# EAGLE design ra8875_40pin_REV-D (EAGLE 6.4)
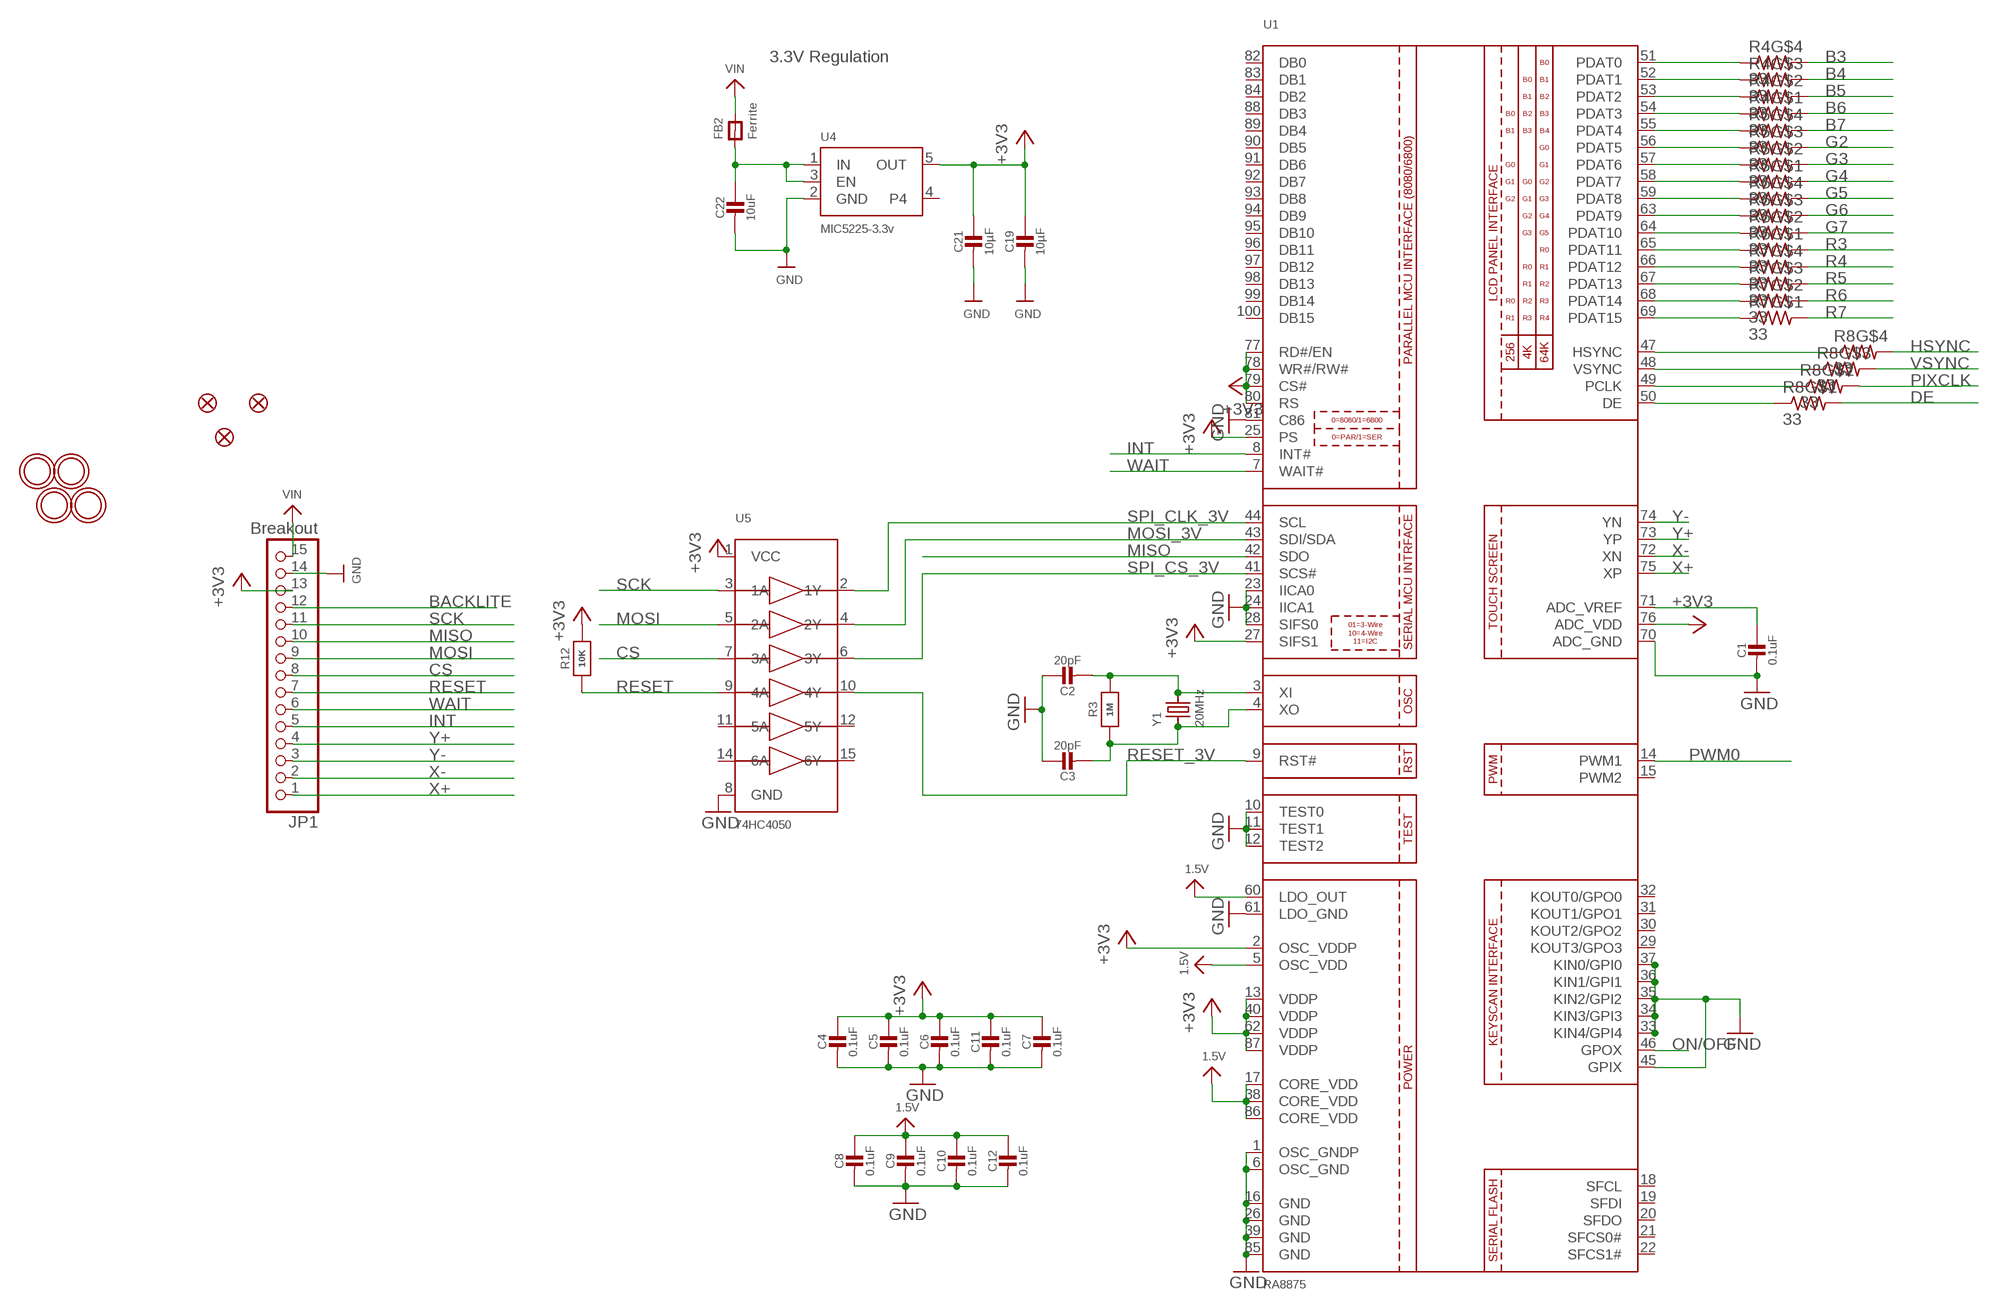
[diagram p0: schematic, sheet 1, part 1 of 2]
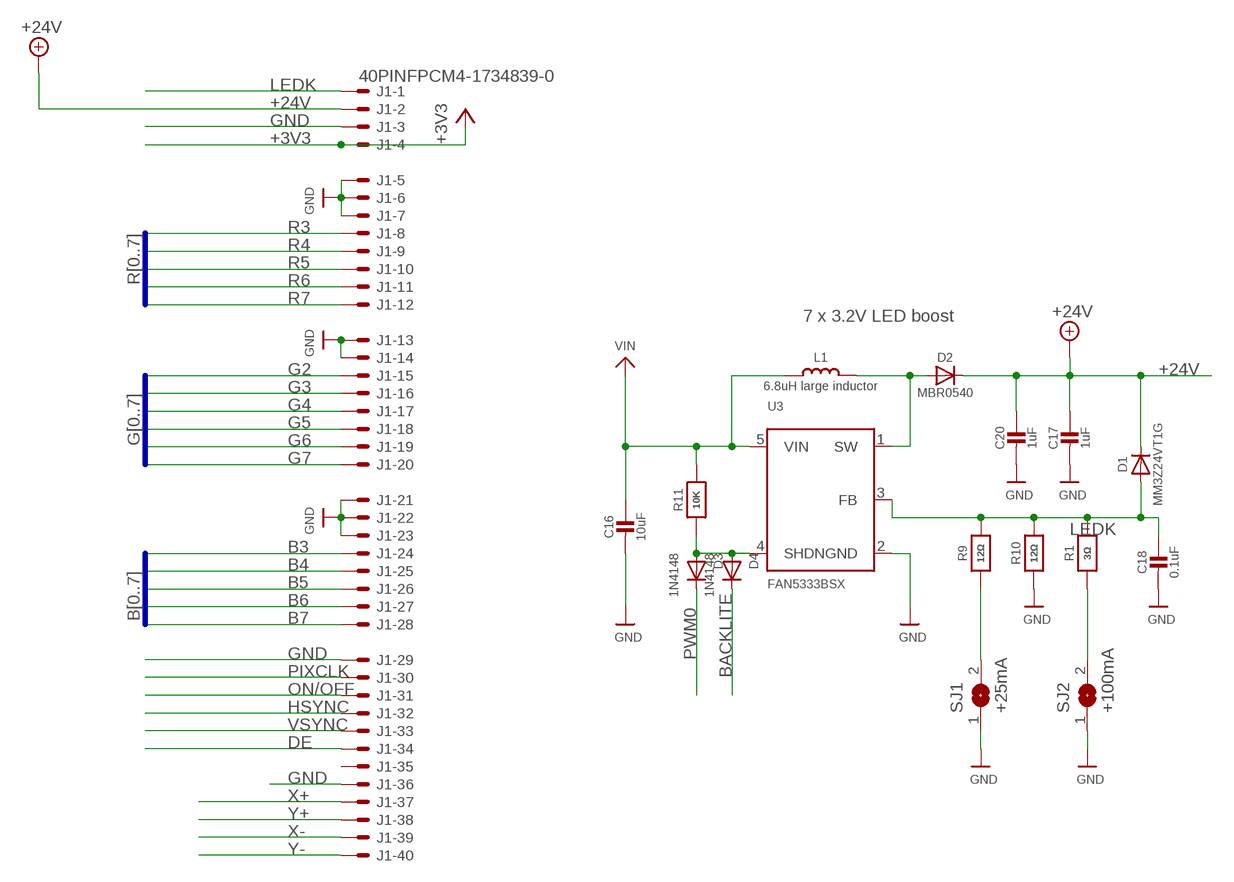
[diagram p1: schematic, sheet 1, part 2 of 2]

## Parts
C1  0.1uF  CAP_CERAMIC0805-NOOUTLINE  [0805-NO]
C2  20pF  CAP_CERAMIC0805-NOOUTLINE  [0805-NO]
C3  20pF  CAP_CERAMIC0805-NOOUTLINE  [0805-NO]
C4  0.1uF  CAP_CERAMIC0805-NOOUTLINE  [0805-NO]
C5  0.1uF  CAP_CERAMIC0805-NOOUTLINE  [0805-NO]
C6  0.1uF  CAP_CERAMIC0805-NOOUTLINE  [0805-NO]
C7  0.1uF  CAP_CERAMIC0805-NOOUTLINE  [0805-NO]
C8  0.1uF  CAP_CERAMIC0805-NOOUTLINE  [0805-NO]
C9  0.1uF  CAP_CERAMIC0805-NOOUTLINE  [0805-NO]
C10  0.1uF  CAP_CERAMIC0805-NOOUTLINE  [0805-NO]
C11  0.1uF  CAP_CERAMIC0805-NOOUTLINE  [0805-NO]
C12  0.1uF  CAP_CERAMIC0805-NOOUTLINE  [0805-NO]
C16  10uF  CAP_CERAMIC_0805MP  [_0805MP]
C17  1uF  CAP_CERAMIC_0805MP  [_0805MP]
C18  0.1uF  CAP_CERAMIC_0805MP  [_0805MP]
C19  10µF  CAP_CERAMIC_0805MP  [_0805MP]
C20  1uF  CAP_CERAMIC_0805MP  [_0805MP]
C21  10µF  CAP_CERAMIC_0805MP  [_0805MP]
C22  10uF  CAP_CERAMIC_0805MP  [_0805MP]
D1  MM3Z24VT1G  DIODESMA  [SMADIODE]
D2  MBR0540  DIODESOD-123  [SOD-123]
D3  1N4148  DIODESOD-323F  [SOD-323F]
D4  1N4148  DIODESOD-323F  [SOD-323F]
FB2  Ferrite  FERRITE_0805MP  [_0805MP]
FID1  FIDUCIAL""  [FIDUCIAL_1MM]
FID2  FIDUCIAL""  [FIDUCIAL_1MM]
FID3  FIDUCIAL""  [FIDUCIAL_1MM]
J1  40PINFPCM4-1734839-0  [4-1734839-0]
JP1  Breakout  PINHD-1X15-CB  [1X15-CB]
L1  6.8uH large inductor  INDUCTORNR5040  [INDUCTOR_5X5MM_NR5040_NOTHERMALS]
R1  3Ω  RESISTOR_0805MP  [_0805MP]
R3  1M  RESISTOR0805_NOOUTLINE  [0805-NO]
R4  33  RESISTOR_4PACK_US  [RESPACK_4X0603]
R5  33  RESISTOR_4PACK_US  [RESPACK_4X0603]
R6  33  RESISTOR_4PACK_US  [RESPACK_4X0603]
R7  33  RESISTOR_4PACK_US  [RESPACK_4X0603]
R8  33  RESISTOR_4PACK_US  [RESPACK_4X0603]
R9  12Ω  RESISTOR_0805MP  [_0805MP]
R10  12Ω  RESISTOR_0805MP  [_0805MP]
R11  10K  RESISTOR_0805MP  [_0805MP]
R12  10K  RESISTOR0805_NOOUTLINE  [0805-NO]
SJ1  +25mA  SOLDERJUMPER  [SOLDERJUMPER_ARROW_NOPASTE]
SJ2  +100mA  SOLDERJUMPER  [SOLDERJUMPER_ARROW_NOPASTE]
U1  RA8875  [LQFP100]
U3  FAN5333BSX  FAN5331  [SOT23-5@1]
U4  MIC5225-3.3v  VREG_SOT23-5  [SOT23-5]
U5  74HC4050  74HC4050D  [SOIC16]
U$21  MOUNTINGHOLE2.5  [MOUNTINGHOLE_2.5_PLATED]
U$22  MOUNTINGHOLE2.5  [MOUNTINGHOLE_2.5_PLATED]
U$23  MOUNTINGHOLE2.5  [MOUNTINGHOLE_2.5_PLATED]
U$24  MOUNTINGHOLE2.5  [MOUNTINGHOLE_2.5_PLATED]
Y1  20MHz  CRYSTAL3.2X2.5  [CRYSTAL_3.2X2.5]

## Nets
1.5V: C8.1 C9.1 C10.1 C12.1 U1.5(OSC_VDD) U1.17(CORE_VDD) U1.38(CORE_VDD) U1.60(LDO_OUT) U1.86(CORE_VDD)
+3V3: C4.1 C5.1 C6.1 C7.1 C11.1 C19.1 C21.1 J1.4 JP1.13 R12.2 U1.2(OSC_VDDP) U1.13(VDDP) U1.25(PS) U1.27(SIFS1) U1.40(VDDP) U1.62(VDDP) U1.76(ADC_VDD) U1.77(RD#/EN) U1.78(WR#/RW#) U1.79(CS#) U1.80(RS) U1.87(VDDP) U4.5(OUT) U5.1(VCC)
+24V: C17.1 C20.1 D1.C D2.C J1.2
B3: J1.24 R4.5
B4: J1.25 R4.6
B5: J1.26 R4.7
B6: J1.27 R4.8
B7: J1.28 R5.5
BACKLITE: D4.C JP1.12
CS: JP1.8 U5.7(3A)
DE: J1.34 R8.8
G2: J1.15 R5.6
G3: J1.16 R5.7
G4: J1.17 R5.8
G5: J1.18 R6.5
G6: J1.19 R6.6
G7: J1.20 R6.7
GND: C1.2 C2.1 C3.1 C4.2 C5.2 C6.2 C7.2 C8.2 C9.2 C10.2 C11.2 C12.2 C16.2 C17.2 C18.2 C19.2 C20.2 C21.2 C22.2 J1.3 J1.5 J1.6 J1.7 J1.13 J1.14 J1.21 J1.22 J1.23 J1.29 J1.36 JP1.14 R10.1 SJ1.1 SJ2.1 U1.1(OSC_GNDP) U1.6(OSC_GND) U1.10(TEST0) U1.11(TEST1) U1.12(TEST2) U1.16(GND) U1.23(IICA0) U1.24(IICA1) U1.26(GND) U1.28(SIFS0) U1.33(KIN4/GPI4) U1.34(KIN3/GPI3) U1.35(KIN2/GPI2) U1.36(KIN1/GPI1) U1.37(KIN0/GPI0) U1.39(GND) U1.45(GPIX) U1.61(LDO_GND) U1.70(ADC_GND) U1.81(C86) U1.85(GND) U3.2(GND) U4.2(GND) U5.8(GND)
HSYNC: J1.32 R8.5
INT: JP1.5 U1.8(INT#)
LEDK: C18.1 D1.A J1.1 R1.2 R9.2 R10.2 U3.3(FB)
MISO: JP1.10 U1.42(SDO)
MOSI: JP1.9 U5.5(2A)
MOSI_3V: U1.43(SDI/SDA) U5.4(2Y)
N$1: D2.A L1.P$2 U3.1(SW)
N$2: C2.2 R3.2 U1.3(XI) Y1.2
N$3: C1.1 U1.71(ADC_VREF)
N$4: R4.4 U1.51(PDAT0)
N$5: R4.3 U1.52(PDAT1)
N$6: R4.2 U1.53(PDAT2)
N$7: R4.1 U1.54(PDAT3)
N$8: R5.4 U1.55(PDAT4)
N$9: R5.3 U1.56(PDAT5)
N$10: R5.2 U1.57(PDAT6)
N$11: R5.1 U1.58(PDAT7)
N$12: R6.4 U1.59(PDAT8)
N$13: R6.3 U1.63(PDAT9)
N$14: R6.2 U1.64(PDAT10)
N$15: R6.1 U1.65(PDAT11)
N$16: R7.4 U1.66(PDAT12)
N$17: R7.3 U1.67(PDAT13)
N$18: R7.2 U1.68(PDAT14)
N$19: R7.1 U1.69(PDAT15)
N$20: R8.1 U1.50(DE)
N$21: R8.2 U1.49(PCLK)
N$22: R8.3 U1.48(VSYNC)
N$23: R8.4 U1.47(HSYNC)
N$24: R9.1 SJ1.2
N$25: C22.1 FB2.1 U4.1(IN) U4.3(EN)
N$26: R1.1 SJ2.2
N$28: C3.2 R3.1 U1.4(XO) Y1.1
ON/OFF: J1.31 U1.46(GPOX)
PIXCLK: J1.30 R8.7
PWM0: D3.C U1.14(PWM1)
R3: J1.8 R6.8
R4: J1.9 R7.5
R5: J1.10 R7.6
R6: J1.11 R7.7
R7: J1.12 R7.8
RESET: JP1.7 R12.1 U5.9(4A)
RESET_3V: U1.9(RST#) U5.10(4Y)
SCK: JP1.11 U5.3(1A)
SHDN: D3.A D4.A R11.1 U3.4(SHDN)
SPI_CLK_3V: U1.44(SCL) U5.2(1Y)
SPI_CS_3V: U1.41(SCS#) U5.6(3Y)
VIN: C16.1 FB2.2 JP1.15 L1.P$1 R11.2 U3.5(VIN)
VSYNC: J1.33 R8.6
WAIT: JP1.6 U1.7(WAIT#)
X+: J1.37 JP1.1 U1.75(XP)
X-: J1.39 JP1.2 U1.72(XN)
Y+: J1.38 JP1.4 U1.73(YP)
Y-: J1.40 JP1.3 U1.74(YN)
Unconnected: J1.35 U1.15(PWM2) U1.18(SFCL) U1.19(SFDI) U1.20(SFDO) U1.21(SFCS0#) U1.22(SFCS1#) U1.29(KOUT3/GPO3) U1.30(KOUT2/GPO2) U1.31(KOUT1/GPO1) U1.32(KOUT0/GPO0) U1.82(DB0) U1.83(DB1) U1.84(DB2) U1.88(DB3) U1.89(DB4) U1.90(DB5) U1.91(DB6) U1.92(DB7) U1.93(DB8) U1.94(DB9) U1.95(DB10) U1.96(DB11) U1.97(DB12) U1.98(DB13) U1.99(DB14) U1.100(DB15) U4.4 U5.11(5A) U5.12(5Y) U5.14(6A) U5.15(6Y)

## Buses
R[0..7]
G[0..7]
B[0..7]

## Notes on the sheet
- 3.3V Regulation
- 7 x 3.2V LED boost

## Library data of the parts
C1-C12 C16-C22 = microbuilder:CAP_CERAMIC: Ceramic Capacitors For new designs, use the packages preceded by an '_' character since they are more reliable: The following footprints should be used on most boards: _0402 - Standard footprint for regular board layouts _0603 - Standard footprint for regular board layouts _0805 - Standard footprint for regular board layouts _1206 - Standard footprint for regular board layouts For extremely tight-pitch boards where space is at a premium, the following 'micro-pitch' footprints can be used (smaller pads, no silkscreen outline, etc.): _0402MP - Micro-pitch footprint for very dense/compact boards _0603MP - Micro-pitch footprint for very dense/compact boards _0805MP - Micro-pitch footprint for very dense/compact boards _1206MP - Micro-pitch footprint for very dense/compact boards
D1 D2 = microbuilder:DIODE: Diode
D3 D4 = adafruit:DIODE: Diode
FB2 = microbuilder:FERRITE: Ferrite Bead 0603 MMZ1608B121C - 120 Ohm @ 100MHz, 600mA, 0.15 Ohm DC Resistance - Digikey: 445-2164-1-ND BK1608HW121-T - 120 Ohm, 600mA Ferrite Chip - Digikey: 587-1876-2-ND 0805 HZ0805B272R-10 - 2.7K Ohm @ 100MHz, 200mA, 0.8 Ohm DC Resistance - Digikey: 240-2504-1-ND (see also Murata BLM21BD272SN1L) MMZ2012Y152B - 1.5K Ohm @ 100MHz, 500mA, 0.4 Ohm DC Resistance - Digikey: 445-1560-1-ND - Mainly for high frequency (80-400MHz) MMZ2012R102A - 1K Ohm @ 100MHz, 500mA, 0.3 Ohm DC Resistance - Digikey: 445-1555-2-ND - More general purpose (10-200MHz)
FID1-FID3 = microbuilder:FIDUCIAL: Fiducial Alignment Points Various fiducial points for machine vision alignment.; BOM: EXCLUDE
J1 = adafruit:40PINFPC: OMRON FPC Connector Source : http://www.omron.com/ecb/products/pdf/fpc.pdf XF2M-4015-rev is good for connecting up 'PSP' SHARP LQ043 LCDs
JP1 = adafruit:PINHD-1X15: PIN HEADER
L1 = microbuilder:INDUCTOR: Inductors 0603: 10nH Ceramic Inductor - microwire antenna/RF (Digikey: 712-1434-2-ND) 0805: 560nH Ceramic Inductor - RF (Digikey: 553-1047-1-ND) 270nH Ceramic Inductor - Q = 40@250MHz, +-5%, 1 Ohm DC Resistance (Digikey: 535-10506-2-ND) 1007 (2518 Metric) SMT: 10µH 10% 250mOhm 820mA 1007 Inductor (Digikey: 587-2189-1-ND) 22µH 10% 500mOhm 580mA 1007 Inductor (Digikey: 587-2190-1-ND) 47µH 10% 950mOhm 420mA 1007 Inductor (Digikey: 587-2191-1-ND) 47µH 5% 100mOhm 1A 1008 Inductor (Digikey: 732-1816-1-ND) 5.0x5.0mm (Taiyo Yuden NR5040 Series) 6.8µH 20% 2.3A 64mOhm Inductor (Digikey: 587-2374-2-ND) 5.0x5.0mm (TDK VLC5045 Series) 4.7µH 20% 3.3A 34mOhm Inductor (Digikey: 445-6526-1-ND) 6.8µH 20% 2.7A 46mOhm Inductor (Digikey: 445-6527-1-ND) 6.0x6.0mm (TDK VLC6045 Series) 4.7µH 20% 3.8A 27mOhm Inductor (Digikey: 445-6538-2-ND) 6.8µH 20% 3A 41mOhm Inductor (Digikey: 445-6540-1-ND) 6.2µH 30% 2.2A 45mOhm Inductor (Digikey: SRR5028-6R2YCT-ND) - Not TDK VLC6045 but footprint should match 6.0x6.0mm (TDK SLF6045 Series) 6.8uH 30% 2A 33mOhm Inductor (Digikey: 445-4572-1-ND, Mouser: 810-SLF645T6R8N2R0PF) 6.0x6.0mm (Sumida CDRH5D28 Series) 6.2uH 30% 1.8A 45mOhm Inductor (Digikey: 308-1542-1-ND) Taiyo Yuden NR3015T2R2M - 2.2uH 20% 1.5A (Digikey: 587-1648-2-ND, Mouser: 963-NR3015T2R2M) - Used with TI TPS62172 CoilCraft RFID Transponder Coil - MA5532-AE (For use with AS3935 Lightning Sensor)
R1 R3 R9-R12 = microbuilder:RESISTOR: Resistors For new designs, use the packages preceded by an '_' character since they are more reliable: The following footprints should be used on most boards: _0402 - Standard footprint for regular board layouts _0603 - Standard footprint for regular board layouts _0805 - Standard footprint for regular board layouts _1206 - Standard footprint for regular board layouts For extremely tight-pitch boards where space is at a premium, the following 'micro-pitch' footprints can be used (smaller pads, no silkscreen outline, etc.): _0402MP - Micro-pitch footprint for very dense/compact boards _0603MP - Micro-pitch footprint for very dense/compact boards _0805MP - Micro-pitch footprint for very dense/compact boards _1206MP - Micro-pitch footprint for very dense/compact boards
R4-R8 = microbuilder:RESISTOR_4PACK_US: Resistor Packs (4 resistors) 4 x 0603 10K 1/16W - Digikey: YC164J-10KCT-ND
SJ1 SJ2 = microbuilder:SOLDERJUMPER: SMD Solder JUMPER Solder the two pads together to create a connection, or remove the solder to break it. REFLOW - Use this footprint for solder paste and reflow ovens. WAVE - Use this footprint for hand-soldering (larger pads). CLOSED - Has a trace between the two pads to ensure it is closed by default. The trace needs to be cut to disable the jumper, and can be closed again by creating a solder bridge between the two pads.; BOM: EXCLUDE
U1 = microbuilder:RA8875: RA8875 TFT LCD Controller
U3 = microbuilder:FAN5331: FAN5331 - LED/OLED 20V Boost Converter Digikey: FAN5331SXCT-ND
U4 = microbuilder:VREG_SOT23-5: SOT23-5 Fixed Voltage Regulators Part Current Out V Out V In V Dropout θJA (°C/W) TJ (°C) Digikey Part No. ADP121 150mA 3.3V 3.4-5.5V 0.09V @ 150mA -- -- ADP121-AUJZ33R7CT-ND ADP121 150mA 3.0V 3.1-5.5V 0.09V @ 150mA -- -- ADP121-AUJZ30R7CT-ND ADP122 300mA 3.3V 3.4-5.5V 0.085V @ 300mA -- -- ADP122AUJZ-3.3-R7CT-ND ADP1712 300mA 3.3V 3.5-5.5V 0.17V @ 300mA -- -- ADP1712AUJZ-3.3-R7TR-ND AP7311 (Low Cost) 150mA 3.3V 3.5-6V 0.15V @ 150mA -- -- AP7311-33WG-7DICT-ND LD39015M18R 150mA 1.8V 1.9V-5.5V 0.08V @ 100mA -- -- 497-6977-1-ND LP2985A-33DBVR 150mA 3.3V 3.3-16V 0.28V @ 150mA 206 150 296-18479-1-ND MCP1824T-3302E/OT 300mA 3.3V 3.5V-6V 0.2V @ 300mA -- -- MCP1824T-3302E/OTCT-ND MIC5205-2.5YM5 TR 150mA 2.5V 2.7-16V 0.165V @ 150mA -- -- 576-1257-2-ND MIC5205-3.0YM5 TR 150mA 3.0V 3.2V-16V 0.165V @ 150mA -- -- 576-1258-2-ND MIC5205-3.3YM5 TR 150mA 3.3V 3.5V-16V 0.165V @ 150mA -- -- 576-1259-2-ND TPS780330220 150mA 3.3V+2.2V 3.6-5.5V 250mV Max -- -- 296-23332-1-ND TDA3663/N1,135 100mA 3.3V 3.5-45V 0.18V @ 50mA -- -- 568-5343-1-ND Max operating temp can be calculated using θJA, TJ (max junction temperature), and power in watts. Set the "Maximum Ambient Temperature" until it reaches TJ ("Max Junction Temperature"), which is the absolute limit for safe use of the regulator: Heat Sink Temperature Calculator <http://www.daycounter.com/Calculators/Heat-Sink-Temperature-Calculator.phtml> For example, With 12V source into a 3.3V LP2985 and a 30mA load, we are dissipating (12V-3.3V) * 0.03A = 0.261W. With a θJA of 206 °C/W, a TJ of 150°C, and 261mW we can safely use the chip without a heat sink up to 75°C (=147.1°C Junction Temperature).
U5 = microbuilder:74HC4050D: 6-channel level shifter 74HC4050D - 2V-6V Supply SOIC16 Digikey: 74HC4050D,653-ND Mouser: 771-74HC4050D-T TSSOP16 Digikey: 296-9215-1-ND Mouser:
U$21-U$24 = microbuilder:MOUNTINGHOLE: Mounting Hole For #2 screws (0.086"/2.18mm width, 0.094"/2.4mm hole) use 2.5mm; BOM: EXCLUDE
Y1 = microbuilder:CRYSTAL: Crystals HC49UP - Surface Mount Crystal 4.0MHz 18pF +/-30ppm Surface Mount Crystal [Digikey: 535-9857-1-ND] 12.0 MHz Surface Mount Crystal [Digikey: 535-9869-6-ND] 25.0 MHz Surface Mount Crystal [Digikey: 535-9078-1-ND] 2.5 x 2.0mm - MEMs SMT Crystal 16.0 MHz 10pF 20ppm 2.5 x 2.0mm Crystal [Digikey -40-85°C: 535-10923-1-ND] 3.2 x 2.5mm - MEMs SMT Crystal 12.0 MHz 8pF 15ppm 3.2 x 2.5mm Crystal [Digikey: -10-70°C: 644-1047-1-ND -40-125°C: 644-1128-1-ND] 40~85°C cheaper: 644-1173-6-ND 16.0 MHz 8pF 15ppm 3.2 x 2.5mm Crystal [Digikey: -10-70°C: 644-1049-1-ND -40-125°C: 644-1129-2-ND]-40~85°C cheaper: 644-1175-6-ND 16.0 MHz 10pF 10ppm 3.2 x 2.5mm Crystal [Digikey: 644-1100-1-ND] 27.12 MHz 18pF 30ppm 3.2 x 2.5mm Crystal [Digikey: 887-1424-1-ND] 27.12MHz 10pF 10ppm 3.2 x 2.5mm Crystal [Digikey: 887-1329-1-ND] 4.9 x 1.8mm - MEMs SMT Crystal 32.768 KHz 12.5pF 20ppm 4.9 x 1.8mm Crystal [Digikey: SE2415CT-ND] 8.0 x 3.8mm - Surface Mount Crystal 32.768kHz 12.5pF 20ppm -40°C-85°C [Digikey: 535-9166-2-ND] Cylinder 32.768KHz Cylinder Crystal (2x6mm body) [Ex. Digikey: 300-8341-2-ND]

## Board
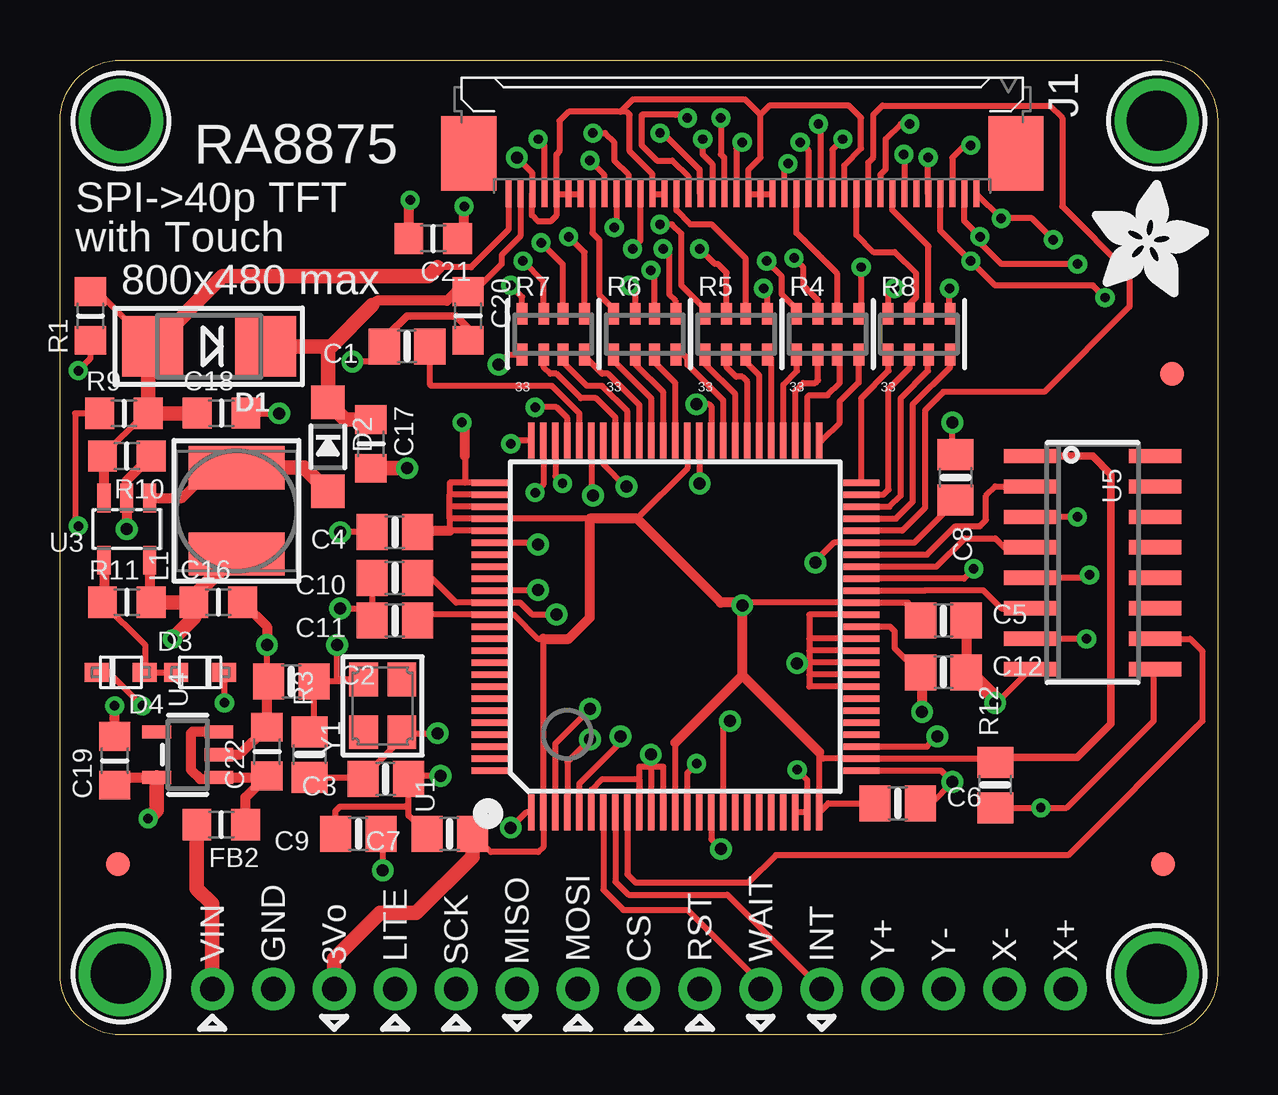
[diagram p2: board, top side]
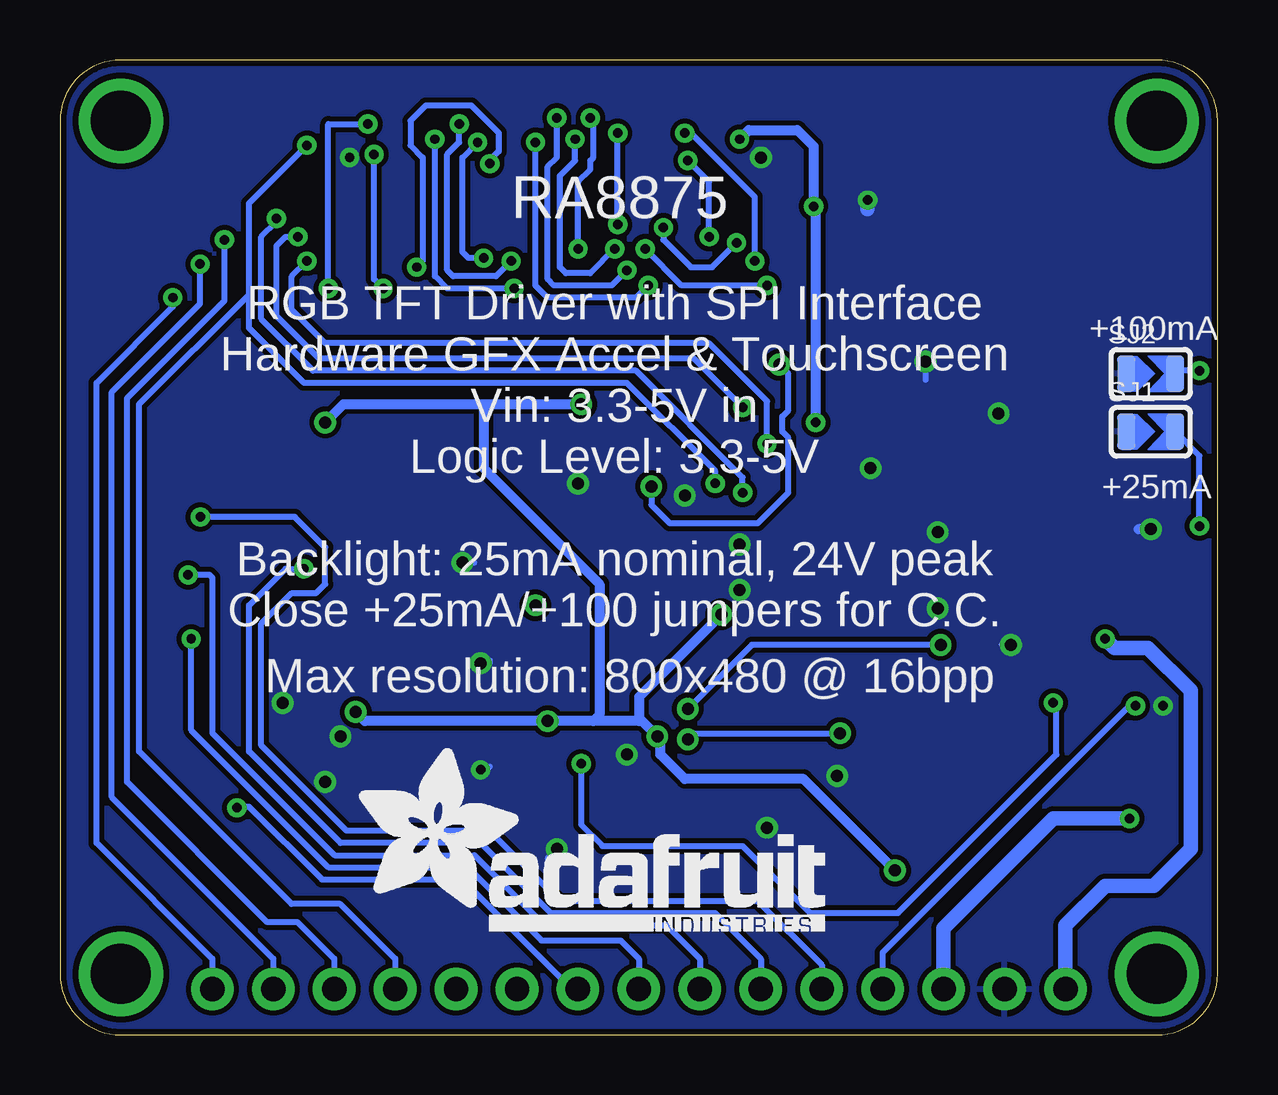
[diagram p3: board, bottom side, seen from below]

Size 48.26 x 40.64 mm. Coordinates in mm from the lower left corner, seen from the top.
Outline: 2.54,40.64 45.72,40.64 arc-90 48.26,38.1 48.26,2.54 arc-90 45.72,0 2.54,0 arc-90 0,2.54 0,38.1 arc-90 2.54,40.64
Copper layers (1*16): Top 0.035mm / dielectric 1.5mm / Bottom 0.035mm
Design rules "adafruit *": minimum track width 8mil, minimum drill 15.5mil, track to track 8mil, track to pad 8mil, pad to pad 8mil, via to via 8mil, smd to smd 8mil, copper to edge 10mil, drill to drill 8mil, minimum pad ring 10mil, minimum via ring 8mil, stop-mask expansion 4mil, vias tented up to drill 20mil, thermal gap 10mil

### Footprints (pad centres in the part's own frame; a part is rotated, then mirrored left to right if it is on the bottom)
0805-NO = smd 1.3 x 1.5: 1 -0.95,0; 2 0.95,0
_0805MP = smd 1.2 x 1.3: 1 -1.016,0; 2 1.016,0
SMADIODE = smd 2.54 x 2.54: A 2.349,0; C -2.349,0
SOD-123 = smd 1.4 x 1.4: A 1.85,0; C -1.85,0
SOD-323F = smd 1 x 0.8: A -1,0; C 1,0
FIDUCIAL_1MM = smd 1 x 1: 1 0,0
4-1734839-0 = smd 0.25 x 1.1: 1 -9.75,-2.54; 2 -9.25,-2.54; 3 -8.75,-2.54; 4 -8.25,-2.54; 5 -7.75,-2.54; 6 -7.25,-2.54; 7 -6.75,-2.54; 8 -6.25,-2.54; 9 -5.75,-2.54; 10 -5.25,-2.54; 11 -4.75,-2.54; 12 -4.25,-2.54; 13 -3.75,-2.54; 14 -3.25,-2.54; 15 -2.75,-2.54; 16 -2.25,-2.54; 17 -1.75,-2.54; 18 -1.25,-2.54; 19 -0.75,-2.54; 20 -0.25,-2.54; 21 0.25,-2.54; 22 0.75,-2.54; 23 1.25,-2.54; 24 1.75,-2.54; 25 2.25,-2.54; 26 2.75,-2.54; 27 3.25,-2.54; 28 3.75,-2.54; 29 4.25,-2.54; 30 4.75,-2.54; 31 5.25,-2.54; 32 5.75,-2.54; 33 6.25,-2.54; 34 6.75,-2.54; 35 7.25,-2.54; 36 7.75,-2.54; 37 8.25,-2.54; 38 8.75,-2.54; 39 9.25,-2.54; 40 9.75,-2.54 | smd 2.3 x 3.1: M1 11.4,-0.84; M2 -11.4,-0.84
1X15-CB = drill 1.016 pad 1.778: 1 -17.78,0; 2 -15.24,0; 3 -12.7,0; 4 -10.16,0; 5 -7.62,0; 6 -5.08,0; 7 -2.54,0; 8 0,0; 9 2.54,0; 10 5.08,0; 11 7.62,0; 12 10.16,0; 13 12.7,0; 14 15.24,0; 15 17.78,0
INDUCTOR_5X5MM_NR5040_NOTHERMALS = smd 1.8 x 4: P$1 -1.8,0; P$2 1.8,0
RESPACK_4X0603 = smd 0.45 x 0.9: 1 -1.3,-0.85; 2 -0.4,-0.85; 3 0.4,-0.85; 4 1.3,-0.85; 5 1.3,0.85; 6 0.4,0.85; 7 -0.4,0.85; 8 -1.3,0.85
SOLDERJUMPER_ARROW_NOPASTE = smd 0.762 x 1.524: 1 -1.016,0; 2 1.016,0
LQFP100 = smd 0.27 x 1.5: 1 -6,-7.75; 2 -5.5,-7.75; 3 -5,-7.75; 4 -4.5,-7.75; 5 -4,-7.75; 6 -3.5,-7.75; 7 -3,-7.75; 8 -2.5,-7.75; 9 -2,-7.75; 10 -1.5,-7.75; 11 -1,-7.75; 12 -0.5,-7.75; 13 0,-7.75; 14 0.5,-7.75; 15 1,-7.75; 16 1.5,-7.75; 17 2,-7.75; 18 2.5,-7.75; 19 3,-7.75; 20 3.5,-7.75; 21 4,-7.75; 22 4.5,-7.75; 23 5,-7.75; 24 5.5,-7.75; 25 6,-7.75; 51 6,7.75; 52 5.5,7.75; 53 5,7.75; 54 4.5,7.75; 55 4,7.75; 56 3.5,7.75; 57 3,7.75; 58 2.5,7.75; 59 2,7.75; 60 1.5,7.75; 61 1,7.75; 62 0.5,7.75; 63 0,7.75; 64 -0.5,7.75; 65 -1,7.75; 66 -1.5,7.75; 67 -2,7.75; 68 -2.5,7.75; 69 -3,7.75; 70 -3.5,7.75; 71 -4,7.75; 72 -4.5,7.75; 73 -5,7.75; 74 -5.5,7.75; 75 -6,7.75 | smd 1.5 x 0.27: 26 7.75,-6; 27 7.75,-5.5; 28 7.75,-5; 29 7.75,-4.5; 30 7.75,-4; 31 7.75,-3.5; 32 7.75,-3; 33 7.75,-2.5; 34 7.75,-2; 35 7.75,-1.5; 36 7.75,-1; 37 7.75,-0.5; 38 7.75,0; 39 7.75,0.5; 40 7.75,1; 41 7.75,1.5; 42 7.75,2; 43 7.75,2.5; 44 7.75,3; 45 7.75,3.5; 46 7.75,4; 47 7.75,4.5; 48 7.75,5; 49 7.75,5.5; 50 7.75,6; 76 -7.75,6; 77 -7.75,5.5; 78 -7.75,5; 79 -7.75,4.5; 80 -7.75,4; 81 -7.75,3.5; 82 -7.75,3; 83 -7.75,2.5; 84 -7.75,2; 85 -7.75,1.5; 86 -7.75,1; 87 -7.75,0.5; 88 -7.75,0; 89 -7.75,-0.5; 90 -7.75,-1; 91 -7.75,-1.5; 92 -7.75,-2; 93 -7.75,-2.5; 94 -7.75,-3; 95 -7.75,-3.5; 96 -7.75,-4; 97 -7.75,-4.5; 98 -7.75,-5; 99 -7.75,-5.5; 100 -7.75,-6
SOT23-5@1 = smd 0.55 x 1.2: 1 -0.95,-1.3; 2 0,-1.3; 3 0.95,-1.3; 4 0.95,1.3; 5 -0.95,1.3
SOT23-5 = smd 0.55 x 1.2: 1 -0.95,-1.3; 2 0,-1.3; 3 0.95,-1.3; 4 0.95,1.3; 5 -0.95,1.3
SOIC16 = smd 0.6 x 2.2: 1 -4.445,-2.6; 2 -3.175,-2.6; 3 -1.905,-2.6; 4 -0.635,-2.6; 5 0.635,-2.6; 6 1.905,-2.6; 7 3.175,-2.6; 8 4.445,-2.6; 9 4.445,2.6; 10 3.175,2.6; 11 1.905,2.6; 12 0.635,2.6; 13 -0.635,2.6; 14 -1.905,2.6; 15 -3.175,2.6; 16 -4.445,2.6
MOUNTINGHOLE_2.5_PLATED = drill 2.5 pad 3.2: P$1 0,0
CRYSTAL_3.2X2.5 = smd 1.4 x 1.2: 1 -1.1,-0.8; 2 1.1,0.8; GND1 -1.1,0.8; GND2 1.1,-0.8

### Placement (x,y rotation side)
C1  14.47,28.7 180 top
C2  9.64,14.73 0 top
C3  13.58,10.67 180 top
C4  13.96,20.95 180 top
C5  36.82,17.27 0 top
C6  34.92,9.65 0 top
C7  16.25,8.38 180 top
C8  37.33,23.24 270 top
C9  12.44,8.38 180 top
C10  13.96,19.05 180 top
C11  13.96,17.27 180 top
C12  36.82,15.11 0 top
C16  6.6,18.03 0 top
C17  12.96,24.64 270 top
C18  6.73,25.92 0 top
C19  2.28,11.43 90 top
C20  17.01,29.97 270 top
C21  15.56,33.2 180 top
C22  8.63,11.81 90 top
D1  6.21,28.7 180 top
D2  11.17,24.51 270 top
D3  5.84,15.11 0 top
D4  2.54,15.11 180 top
FB2  6.72,8.76 180 top
FID1  2.41,7.11 0 top
FID2  45.97,7.11 0 top
FID3  46.35,27.56 0 top
J1  28.44,37.59 0 top
JP1  24.13,1.91 180 top
L1  7.36,21.84 90 top
R1  1.27,29.97 90 top
R3  10.41,11.68 90 top
R4  32,29.21 0 top
R5  28.19,29.21 0 top
R6  24.38,29.21 0 top
R7  20.57,29.21 0 top
R8  35.81,29.21 0 top
R9  2.67,25.91 0 top
R10  2.79,24.13 180 top
R11  2.79,18.03 0 top
R12  38.98,10.41 90 top
SJ1  2.79,25.15 0 bottom
SJ2  2.79,27.56 0 bottom
U1  25.65,17.02 0 top
U3  2.79,21.08 180 top
U4  5.33,11.68 90 top
U5  43.05,19.68 270 top
U$18  [ADAFRUIT_5MM]  43.02,30.76 0 top
U$21  2.54,38.1 0 top
U$22  45.72,38.1 0 top
U$23  45.72,2.54 0 top
U$24  2.54,2.54 0 top
U$25  [ADAFRUIT_TEXT_20MM]  35.94,4.32 0 bottom
Y1  13.45,13.72 90 top

### Tracks (layer width: path | path; a pad name or v marks a point on that pad's centre or on a via)
1.5V  (via drill 0.5)
  Top 0.254: C10.1 15.49,19.05 16.52,18.02 U1.86 19.18,18.02 19.68,17.53 v20.69,17.53 | U1.38 34.6,17.02 34.79,16.83 34.79,16.13 35.81,15.11 C12.1 35.93,15.05 | C8.1 37.2,24.32 v37.2,25.53 | U1.60 27.15,26.19 27.05,26.29 v26.54,26.29 | U1.17 27.65,12.79 v27.93,13.08 | U1.5 21.65,10.48 23.23,12.06 23.23,12.32 v23.36,12.45 | C9.1 13.45,8.32 v13.45,6.86
  Top 0.406: 35.93,15.05 v35.93,13.46
  Bottom 0.254: 24,13.08 24.12,13.08 | 23.23,12.32 v23.36,12.45
  Bottom 0.406: v37.2,25.53 36.44,26.29 30.6,26.29 | 30.6,26.29 v26.54,26.29 | v35.93,13.46 35.55,13.08 v27.93,13.08 26.03,13.08 | v23.36,12.45 24,13.08 | 26.03,13.08 24.12,13.08 24.12,14.1 v20.69,17.53 | v13.45,6.86 17.26,10.67 22.22,10.67 23.23,11.68 23.23,12.32 | 30.6,26.29 30.6,23.62 25.77,18.8 25.77,13.34 26.03,13.08
+3V3  (via drill 0.39, 0.5)
  Top 0.254: C4.1 | U1.77 16.25,22.52 | U1.76 16.88,23.02 | 16.88,23.02 16.25,23.02 16.25,22.52 | U1.78 16.25,22.02 | 16.25,22.02 16.25,22.52 | 16.25,21.52 16.25,22.02 | C11.1 15.16,17.52 U1.87 18.92,17.52 19.93,16.51 20.15,16.51 U1.2 20.15,7.83 19.93,7.62 17.96,7.62 C7.1 | 16.25,21.52 U1.79 22.09,21.52 | 16.25,21.52 16.25,21.02 U1.80 | U1.62 26.15,23.61 24.05,21.52 | C6.1 32.02,9.65 U1.25 31.65,11.68 | C5.1 35.87,17.49 35.35,18.02 U1.40 28.57,18.02 28.44,17.89 v28.44,17.91 | 31.65,11.68 31.65,11.78 | U1.13 25.65,12.19 | 31.65,11.68 31.81,11.52 U1.27 38.83,11.52 arc-90 R12.2 | J1.4 20.19,37.08 v19.93,37.34 | 16.88,24.13 16.88,23.02
  Top 0.305: U5.1 43.05,24.13 43.81,23.37 43.81,12.95 42.41,11.56 39.17,11.56 R12.2
  Top 0.406: 28.57,18.02 27.55,18.02 24.05,21.52 22.09,21.52 22.09,17.4 21.2,16.51 20.15,16.51 | 31.65,11.78 28.44,14.99 | 28.44,14.99 v28.44,17.91 | 25.65,12.19 28.44,14.99 | 16.83,34.52 v16.85,34.54 16.85,33.47 C21.1 | C4.1 14.97,21.02 16.25,21.02 | 16.88,24.13 16.88,25.4 v16.76,25.53 | U4.5 2.47,10.73 2.28,10.54 C19.1
  Top 0.61: U4.5 4.03,9.37 v3.67,9.02 | C7.1 17.2,7.43 14.85,5.08 13.34,5.08 11.43,3.17 JP1.13
  Bottom 0.406: v16.76,25.53 16.76,34.45 v16.85,34.54 16.85,37.04 17.53,37.72 19.55,37.72 v19.93,37.34
  Bottom 0.61: 28.44,17.78 v28.44,17.91 | v3.67,9.02 6.85,9.02 11.43,4.44 JP1.13
+24V
  Top 0.254: C20.1 17.26,30.99 18.41,32.13 18.41,32.51 19.19,33.3 J1.2
  Top 0.406: C20.1 16.51,30.99 16.13,30.61 13.21,30.61 13.02,30.42
  Top 0.61: D1.C 11.3,28.7 | 11.3,28.7 13.02,30.42 | C17.1 11.88,25.65 D2.C 11.17,28.57 11.3,28.7
B3  (via drill 0.39)
  Top 0.254: J1.24 30.19,36.22 30.29,36.32 v30.34,36.32 | v33.39,32 33.39,30.16 R4.5
  Bottom 0.254: v33.39,32 33.14,32.26 33.14,36.58 33.65,37.08 33.65,38.1 33.01,38.73 31.11,38.73 29.97,37.6 29.97,36.83 30.34,36.46 v30.34,36.32
B4
  Top 0.254: R4.6 32.4,31.73 30.69,33.44 J1.25
B5  (via drill 0.39)
  Top 0.254: R4.7 31.6,30.63 30.98,31.24 30.98,32 v30.6,32.38 | v30.85,37.21 31.19,36.87 J1.26
  Bottom 0.254: v30.6,32.38 31.23,32.38 31.49,32.64 31.49,36.58 v30.85,37.21
B6  (via drill 0.39)
  Top 0.254: R4.8 30.7,30.26 30.09,30.86 30.09,31.62 v29.46,32.26 | v31.61,37.97 31.69,37.9 J1.27
  Bottom 0.254: v29.46,32.26 30.09,31.62 31.87,31.62 32.12,31.88 32.12,36.7 31.61,37.21 v31.61,37.97
B7  (via drill 0.39)
  Top 0.254: R5.5 29.49,30.96 v29.33,31.11 | v32.63,37.34 32.19,36.9 J1.28
  Bottom 0.254: v29.33,31.11 32.12,31.11 32.63,31.62 v32.63,37.34
BACKLITE  (via drill 0.39)
  Top 0.254: D4.C 2.03,15.11 v3.43,13.72
  Bottom 0.254: v3.43,13.72 3.68,13.72 13.97,3.43 JP1.12
CS  (via drill 0.39)
  Top 0.254: v42.79,16.51 U5.7
  Bottom 0.254: v42.79,16.51 42.79,12.7 37.08,6.99 31.24,6.99 28.19,3.94 24.89,3.94 24.13,3.17 JP1.8
DE  (via drill 0.39)
  Top 0.254: v35.17,36.7 35.19,36.68 J1.34 | v34.79,31.11 34.51,30.83 R8.8
  Bottom 0.254: v34.79,31.11 35.17,31.5 v35.17,36.7
G2
  Top 0.254: R5.6 28.59,32.37 27.17,33.78 26.28,33.78 25.69,34.37 J1.15
G3  (via drill 0.39)
  Top 0.254: R5.7 27.79,31.77 27.42,32.13 27.3,32.13 v26.66,32.77 | v26.15,38.23 26.03,38.35 25.65,38.35 24.25,38.35 24.25,37.08 24.88,36.45 25.52,36.45 26.19,35.78 J1.16
  Bottom 0.254: v26.66,32.77 26.66,35.56 26.15,36.07 26.15,36.45 26.03,36.58 26.03,38.1 v26.15,38.23
G4  (via drill 0.39)
  Top 0.254: R5.8 26.89,30.26 25.9,31.24 25.9,33.4 25.52,33.78 v25.01,33.78 | J1.17 26.66,35.08 26.66,36.07 25.14,37.59 v25.01,37.59
  Bottom 0.254: v25.01,33.78 v25.01,37.59
G5  (via drill 0.39)
  Top 0.254: v26.79,37.34 26.79,36.7 27.19,36.3 J1.18 | v25.14,32.77 25.39,32.51 25.39,30.86 25.65,30.61 25.65,30.09 R6.5
  Bottom 0.254: v25.14,32.77 26.15,31.75 27.17,31.75 27.42,32 27.42,35.81 26.79,36.45 v26.79,37.34
G6  (via drill 0.39)
  Top 0.254: R6.6 24.78,31.73 v24.63,31.88 | v27.55,38.23 27.55,36.7 27.68,36.58 27.68,35.06 J1.19
  Bottom 0.254: v24.63,31.88 25.27,31.24 27.68,31.24 27.93,31.5 27.93,36.2 27.55,36.58 v27.55,38.23
G7  (via drill 0.39)
  Top 0.254: R6.7 24,30.08 24,30.99 v23.74,31.24 | v28.44,37.21 28.19,36.96 J1.20
  Bottom 0.254: v23.74,31.24 24.25,30.73 27.93,30.73 28.44,31.24 v28.44,37.21
GND  (via drill 0.39, 0.5)
  Top 0.254: C1.2 13.52,28.07 v12.18,28.07 | C10.2 13.01,17.78 | 13.01,17.78 C11.2 | C4.2 v11.68,20.95 | U1.85 17.92,18.54 v19.93,18.54 | U1.81 19.93,20.52 v19.93,20.45 | C2.1 8.63,14.8 v8.63,16.26 | U1.37 31.23,16.52 | 31.23,16.52 31.23,16.02 | 31.23,16.02 31.23,15.52 | 31.23,15.52 31.23,15.49 | 31.23,15.49 31.23,15.02 | 31.23,15.02 31.23,14.52 U1.33 | U1.34 31.23,15.02 | U1.35 31.23,15.52 | U1.36 31.23,16.02 | 31.23,15.49 v30.73,15.49 | C12.2 37.77,15.24 C5.2 37.77,17.56 | U1.61 26.65,22.99 v26.66,22.99 | U1.70 22.15,22.54 22.2,22.48 v22.22,22.48 | U1.39 31.23,17.52 31.23,16.52 | 36.89,22.29 C8.2 37.38,22.29 35.61,20.52 U1.45 32.25,20.52 31.49,19.76 v31.49,19.68 | U1.16 27.15,8.15 v27.55,7.75 | U1.12 25.15,11.18 24.65,11.18 | 24.65,11.18 24.63,11.18 | 24.63,11.18 24.15,11.18 U1.10 24.15,10.64 24.12,10.67 22.6,10.67 22.15,10.22 U1.6 | U1.11 24.65,11.18 | 24.63,11.18 v24.63,11.68 | U1.1 19.42,9.27 v18.79,8.64 | C7.2 14.53,9.15 14.53,9.65 | 14.53,9.65 C3.1 14.66,10.79 v15.87,10.79 | C9.2 11.49,9.34 11.68,9.53 14.4,9.53 14.53,9.65 | U1.26 36.73,11.02 v37.2,10.54 36.31,9.65 C6.2 | U1.23 U1.24 31.15,10.63 v30.73,11.05 | U1.28 36.14,12.02 v36.57,12.45 | J1.14 J1.13 24.69,35.88 23.74,36.83 23.74,38.35 23.61,38.48 23.36,38.48 | J1.5 20.69,36.7 20.82,36.83 20.82,38.1 21.2,38.48 23.36,38.48 | 19.17,36.45 v19.04,36.58 19.69,35.93 J1.3 19.68,35.04 19.68,34.16 19.93,33.91 20.44,33.91 20.69,34.16 J1.5 | J1.23 J1.22 J1.21 28.69,36.06 29.2,36.58 29.2,38.35 | 29.2,38.35 28.57,38.99 23.87,38.99 23.36,38.48 | J1.29 32.69,36.25 33.39,36.96 33.39,38.23 32.88,38.73 29.58,38.73 29.2,38.35 | J1.36 v36.19,36.58 | J1.5 J1.6 J1.7 | v11.68,17.78 13.01,17.78
  Top 0.254: U5.8 39.05,13.84 v38.98,13.84 | C18.2 7.75,25.91 v9.14,25.91
  Top 0.305: C20.2 17.01,29.46 16.5,29.97 14.47,29.97 13.71,29.21 13.71,28.89 C1.2
  Top 0.406: 37.77,17.56 37.77,15.24 | v2.79,21.08 U3.2 2.79,23.11 R10.1 | C16.2 8.63,17.02 v8.63,16.26 | C19.2 v2.28,13.72 | U4.2 7.49,11.68 C22.2 8.63,14.67 C2.1 | C21.2 14.54,34.74 v14.6,34.8
  Top 0.61: C17.2 v14.47,23.62 | 37.77,15.24 38.98,14.03 v38.98,13.84
  Bottom 0.254: v12.18,28.07 12.18,27.3 | v11.68,20.95 11.55,20.83 11.55,20.95 | v19.93,18.54 19.93,18.16 | v19.93,20.45 20.06,20.45 20.06,20.32 | v8.63,16.26 9.01,16.26 | 30.34,15.62 30.34,15.49 | v26.66,22.99 26.66,22.86 26.92,22.86 | v22.22,22.48 22.22,22.35 22.09,22.48 | v31.49,19.68 30.98,19.68 | v27.55,7.75 27.93,7.37 | v18.79,8.64 18.66,8.64 18.53,8.51 | 36.57,12.19 v36.57,12.45 | v19.04,36.58 19.04,36.7 | v36.19,36.58 36.06,36.7 36.06,36.32 | v30.73,11.05 30.47,11.05 30.34,11.18
  Bottom 0.406: v38.98,13.84 38.98,14.1 | v2.79,21.08 3.29,21.08
  Bottom 0.61: v14.6,34.8 14.6,34.42
  pour Bottom: 0,0 48.88,0 49.13,40.64 0.25,40.64
HSYNC  (via drill 0.39)
  Top 0.254: R8.5 37.08,30.09 v37.08,31.11 | v35.42,37.97 35.04,37.97 34.41,37.34 34.41,36.07 34.19,35.85 J1.32
  Bottom 0.254: v37.08,31.11 37.08,37.97 v35.42,37.97
INT
  Top 0.254: U1.8 23.15,6.39 23.69,5.84 27.81,5.84 JP1.5
LEDK
  Top 0.254: J1.1 18.69,33.56 17.14,32 15.75,32 | R9.2 3.55,25.91 R10.2 | R1.2 1.58,30.99 D1.A
  Top 0.406: U3.3 1.84,24.06 R10.2
  Top 0.61: C18.1 5.71,25.91 R9.2 3.68,28.52 D1.A 6.79,31.62 15.37,31.62 15.75,32
MISO  (via drill 0.39)
  Top 0.254: v38.09,19.43 37.68,19.02 U1.42
  Bottom 0.254: v38.09,19.43 38.85,19.43 40.38,17.91 40.38,11.81 36.57,8 30.73,8 27.81,5.08 20.95,5.08 19.05,3.17 JP1.10
MOSI  (via drill 0.39)
  Top 0.254: v42.92,19.18 42.79,19.05 U5.5
  Bottom 0.254: v42.92,19.18 42.03,19.18 41.9,19.05 41.9,12.57 36.82,7.49 30.99,7.49 28.07,4.57 22.99,4.57 21.59,3.17 JP1.9
MOSI_3V
  Top 0.254: U1.43 36.53,19.52 37.71,20.7 38.98,20.7 39.36,20.32 U5.4
N$1
  Top 0.406: U3.1 5.1,22.38 6.09,23.37 7.08,23.37 L1.P$2
  Top 0.61: L1.P$2 10.19,23.64 D2.A
N$2  (via drill 0.5)
  Top 0.254: R3.2 10.59,12.82 C2.2 12.57,14.73 Y1.2 11.55,14.82 v11.55,16.26 | U1.3 20.65,12.14 v22.09,13.59
  Bottom 0.254: v11.55,16.26 19.42,16.26 v22.09,13.59
N$3
  Top 0.254: U1.71 21.65,25.91 20.5,27.05 15.49,27.05 15.42,27.12 C1.1
N$4
  Top 0.254: R4.4 33.3,27.18 33.27,27.18 32.5,26.42 32.5,25.53 31.75,24.77 U1.51
N$5
  Top 0.254: U1.52 31.15,26.58 31.23,26.67 32,26.67 32.5,27.18 32.5,28.25 R4.3
N$6
  Top 0.254: U1.53 30.65,26.84 30.98,27.18 31.49,27.18 31.6,27.29 R4.2
N$7
  Top 0.254: U1.54 30.15,27.11 30.73,27.69 30.73,28.33 R4.1
N$8
  Top 0.254: U1.55 29.65,28.2 R5.4
N$9
  Top 0.254: U1.56 29.15,27.49 28.59,28.05 R5.3
N$10
  Top 0.254: U1.57 28.65,27.23 28.44,27.43 28.19,27.43 27.79,27.83 R5.2
N$11
  Top 0.254: U1.58 28.15,26.71 26.89,27.97 R5.1
N$12
  Top 0.254: U1.59 27.65,26.45 26.15,27.94 26.15,28.19 25.99,28.36 R6.4
N$13
  Top 0.254: U1.63 25.65,27.18 24.78,28.05 R6.3
N$14
  Top 0.254: 23.98,28.09 R6.2 24,28.34 24,27.94 25.15,26.79 U1.64
N$15
  Top 0.254: U1.65 24.65,26.53 23.11,28.07 23.11,28.33 R6.1
N$16
  Top 0.254: 21.92,28.36 R7.4 21.84,28.33 21.84,28.32 22.6,27.56 22.85,27.56 24.15,26.27 U1.66
N$17
  Top 0.254: U1.67 23.65,26 22.6,27.05 21.96,27.05 20.97,28.05 R7.3 21.07,28.25
N$18
  Top 0.254: U1.68 23.15,25.74 22.34,26.54 21.71,26.54 20.69,27.56 20.44,27.56 20.17,27.83 R7.2 20.18,28.34 20.18,27.94
N$19  (via drill 0.5)
  Top 0.254: U1.69 22.65,23.8 23.58,22.86 v23.61,22.86 | v18.28,27.94 18.7,28.36 R7.1
  Bottom 0.254: v23.61,22.86 23.61,22.1 22.85,21.34 19.17,21.34 17.9,22.61 17.9,24.89 18.15,25.15 18.15,25.78 17.9,26.04 17.9,27.56 v18.28,27.94
N$20
  Top 0.254: U1.50 33.4,26.55 34.54,27.69 34.54,28.33 R8.1
N$21
  Top 0.254: U1.49 34.32,22.52 34.54,22.73 34.54,26.92 35.42,27.81 35.42,28.34 R8.2
N$22
  Top 0.254: U1.48 34.58,22.02 35.04,22.48 35.04,26.54 36.19,27.69 36.19,28.34 R8.3
N$23
  Top 0.254: U1.47 34.84,21.52 35.55,22.23 35.55,26.29 37.11,27.84 R8.4
N$24  (via drill 0.39)
  Top 0.254: R9.1 0.64,25.91 0.64,21.34 v0.76,21.21
  Bottom 0.254: v0.76,21.21 0.76,24.13 SJ1.2
N$25
  Top 0.406: FB2.1 7.74,9.91 C22.1 8.57,10.73 U4.1 6.56,10.67 5.83,10.67 5.45,11.05 5.45,12.57 5.51,12.63 U4.3
N$26  (via drill 0.39)
  Top 0.254: R1.1 1.27,28.19 v0.76,27.69
  Bottom 0.254: v0.76,27.69 1.65,27.69 SJ2.2
N$28  (via drill 0.5)
  Top 0.254: Y1.1 14.25,12.36 | 14.25,12.36 13.07,11.18 13.07,11.11 C3.2 12.56,10.73 R3.1 | 14.25,12.36 14.47,12.57 v15.74,12.57 | U1.4 21.15,11.38 v22.09,12.32
  Bottom 0.254: v22.09,12.32 21.84,12.57 v15.74,12.57
ON/OFF
  Top 0.254: J1.31 33.69,36.37 33.9,36.58 33.9,38.35 34.28,38.73 41.27,38.73 41.77,38.23 41.77,34.54 44.58,31.74 44.58,30.35 41.02,26.8 36.82,26.8 36.06,26.04 36.06,21.97 35.11,21.02 U1.46
PIXCLK
  Top 0.254: J1.30 33.19,33.35 33.9,32.64 34.79,32.64 35.68,31.75 35.68,30.73 35.41,30.46 R8.7
PWM0  (via drill 0.39)
  Top 0.254: U1.14 26.15,10.91 v26.54,11.3 | v6.86,13.84 6.86,15.1 D3.C
  Bottom 0.254: v26.54,11.3 26.54,8.76 25.65,7.87 19.8,7.87 17.01,5.08 13.33,5.08 6.72,11.68 6.72,13.71 v6.86,13.84
R3
  Top 0.254: J1.8 22.19,33.43 22.47,33.15 22.47,30.86 23.08,30.26 R6.8
R4  (via drill 0.39)
  Top 0.254: R7.5 21.87,32.61 v21.2,33.27 | J1.9 22.69,35.85 v22.09,36.45
  Bottom 0.254: v21.2,33.27 21.2,35.56 v22.09,36.45
R5  (via drill 0.39)
  Top 0.254: R7.6 20.97,32.11 v20.06,33.02 | J1.10 23.19,33.74 v23.11,33.66
  Bottom 0.254: v23.11,33.66 23.11,33.15 21.96,32 21.07,32 v20.06,33.02
R6  (via drill 0.39)
  Top 0.254: R7.7 20.17,31.39 v19.3,32.26 | v22.22,37.59 22.73,37.59 23.11,37.2 23.11,36.45 23.69,35.87 J1.11
  Bottom 0.254: v19.3,32.26 19.3,34.92 21.96,37.59 v22.22,37.59
R7  (via drill 0.39)
  Top 0.254: R7.8 19.27,30.76 v18.79,31.24 | v23.87,32.77 24.19,33.09 J1.12
  Bottom 0.254: v18.79,31.24 22.34,31.24 v23.87,32.77
RESET  (via drill 0.39)
  Top 0.254: R12.1 v40.89,9.46 41.97,9.46 45.59,13.08 45.59,15.18 U5.9
  Bottom 0.254: v40.89,9.46 40.83,9.53 40.39,9.53 37.34,6.48 31.5,6.48 26.92,1.91 JP1.7
RESET_3V
  Top 0.254: U5.10 47.11,16.51 47.62,16 47.62,13.08 42.03,7.49 29.84,7.49 28.69,6.35 24,6.35 23.65,6.7 U1.9
SCK  (via drill 0.39)
  Top 0.254: v42.41,21.59 U5.3
  Bottom 0.254: v42.41,21.59 38.47,21.59 37.2,20.32 37.2,18.8 37.58,18.41 38.6,18.41 39.87,17.14 39.87,12.06 36.31,8.51 30.35,8.51 27.43,5.59 19.18,5.59 16.51,2.92 JP1.11
SHDN
  Top 0.254: R11.1 3.56,16.25 3.56,15.11 | 3.56,15.11 D4.A | 3.56,15.11 D3.A
  Top 0.406: U3.4 1.84,18.1 R11.1
SPI_CLK_3V
  Top 0.254: U1.44 36.14,20.02 37.33,21.21 38.35,21.21 38.6,21.46 38.6,22.48 38.98,22.86 U5.2
SPI_CS_3V
  Top 0.254: U1.41 36.04,18.52 36.06,18.54 38.47,18.54 39.23,17.78 U5.6
VIN  (via drill 0.39)
  Top 0.406: U3.5 3.74,18.1 R11.2
  Top 0.61: R11.2 C16.1 | C16.1 5.58,18.27 L1.P$1 | FB2.2 5.71,6.1 6.35,5.45 JP1.15 | C16.1 5.59,17.4 v4.7,16.51 v4.69,16.51
  Bottom 0.61: v4.69,16.51 4.31,16.13 2.91,16.13 1.14,14.35 1.14,7.75 2.66,6.22 4.69,6.22 6.35,4.56 JP1.15
VSYNC
  Top 0.254: R8.6 36.21,32.87 34.69,34.39 J1.33
WAIT
  Top 0.254: U1.7 22.65,6.05 23.49,5.21 26.16,5.21 29.21,2.16 JP1.6
X+  (via drill 0.39)
  Top 0.254: U1.75 18.92,24.77 v18.79,24.64 | J1.37 36.69,33.53 v37.97,32.26 38.98,31.24 43.05,31.24 v43.56,30.73
  Bottom 0.254: v18.79,24.64 18.79,26.42 21.2,28.83 37.2,28.83 38.6,30.23 38.6,31.62 v37.97,32.26 | v43.56,30.73 43.56,30.35 46.74,27.18 46.74,8 41.91,3.17 JP1.1
X-  (via drill 0.39)
  Top 0.254: U1.72 21.15,25.71 20.69,26.16 v19.8,26.16 | J1.39 37.69,33.93 v38.35,33.27 38.35,33.02 39.23,32.13 v42.42,32.13
  Bottom 0.254: v19.8,26.16 21.84,28.19 37.46,28.19 39.23,29.97 39.23,32.89 38.85,33.27 v38.35,33.27 | v42.42,32.13 42.42,30.48 46.1,26.8 46.1,9.91 39.37,3.17 JP1.2
Y+  (via drill 0.39)
  Top 0.254: U1.73 20.65,23.29 v20.95,22.99 | v37.97,37.08 37.71,37.08 37.19,36.56 J1.38
  Bottom 0.254: v20.95,22.99 20.95,23.5 24.63,27.18 38.09,27.18 40.38,29.46 40.38,30.87 | 40.38,30.87 40.38,34.67 v37.97,37.08 | 40.38,30.87 44.96,26.29 44.96,11.81 38.61,5.46 36.58,5.46 34.29,3.17 JP1.4
Y-  (via drill 0.39)
  Top 0.254: U1.74 20.15,22.95 v19.8,22.61 | J1.40 38.22,35.05 v39.23,34.04 40.51,34.04 v41.4,33.15
  Bottom 0.254: v19.8,22.61 19.8,23.24 24.25,27.69 37.71,27.69 39.87,29.84 39.87,33.27 39.23,33.91 v39.23,34.04 | v41.4,33.15 41.4,30.61 45.47,26.54 45.47,10.54 39.62,4.7 38.35,4.7 36.83,3.17 JP1.3

### Text on the board
tPlace: RA8875 | SPI->40p TFT | with Touch | 800x480 max | VIN | GND | 3Vo | LITE | SCK | MISO | MOSI | CS | RST | WAIT | INT | Y+ | Y- | X- | X+
bPlace: RA8875 | +100mA | RGB TFT Driver with SPI Interface / Hardware GFX Accel & Touchscreen / Vin: 3.3-5V in / Logic Level: 3.3-5V / / Backlight: 25mA nominal, 24V peak / Close +25mA/+100 jumpers for C.C. | +25mA | Max resolution: 800x480 @ 16bpp